# EAGLE design LME49811 (EAGLE 5.07)
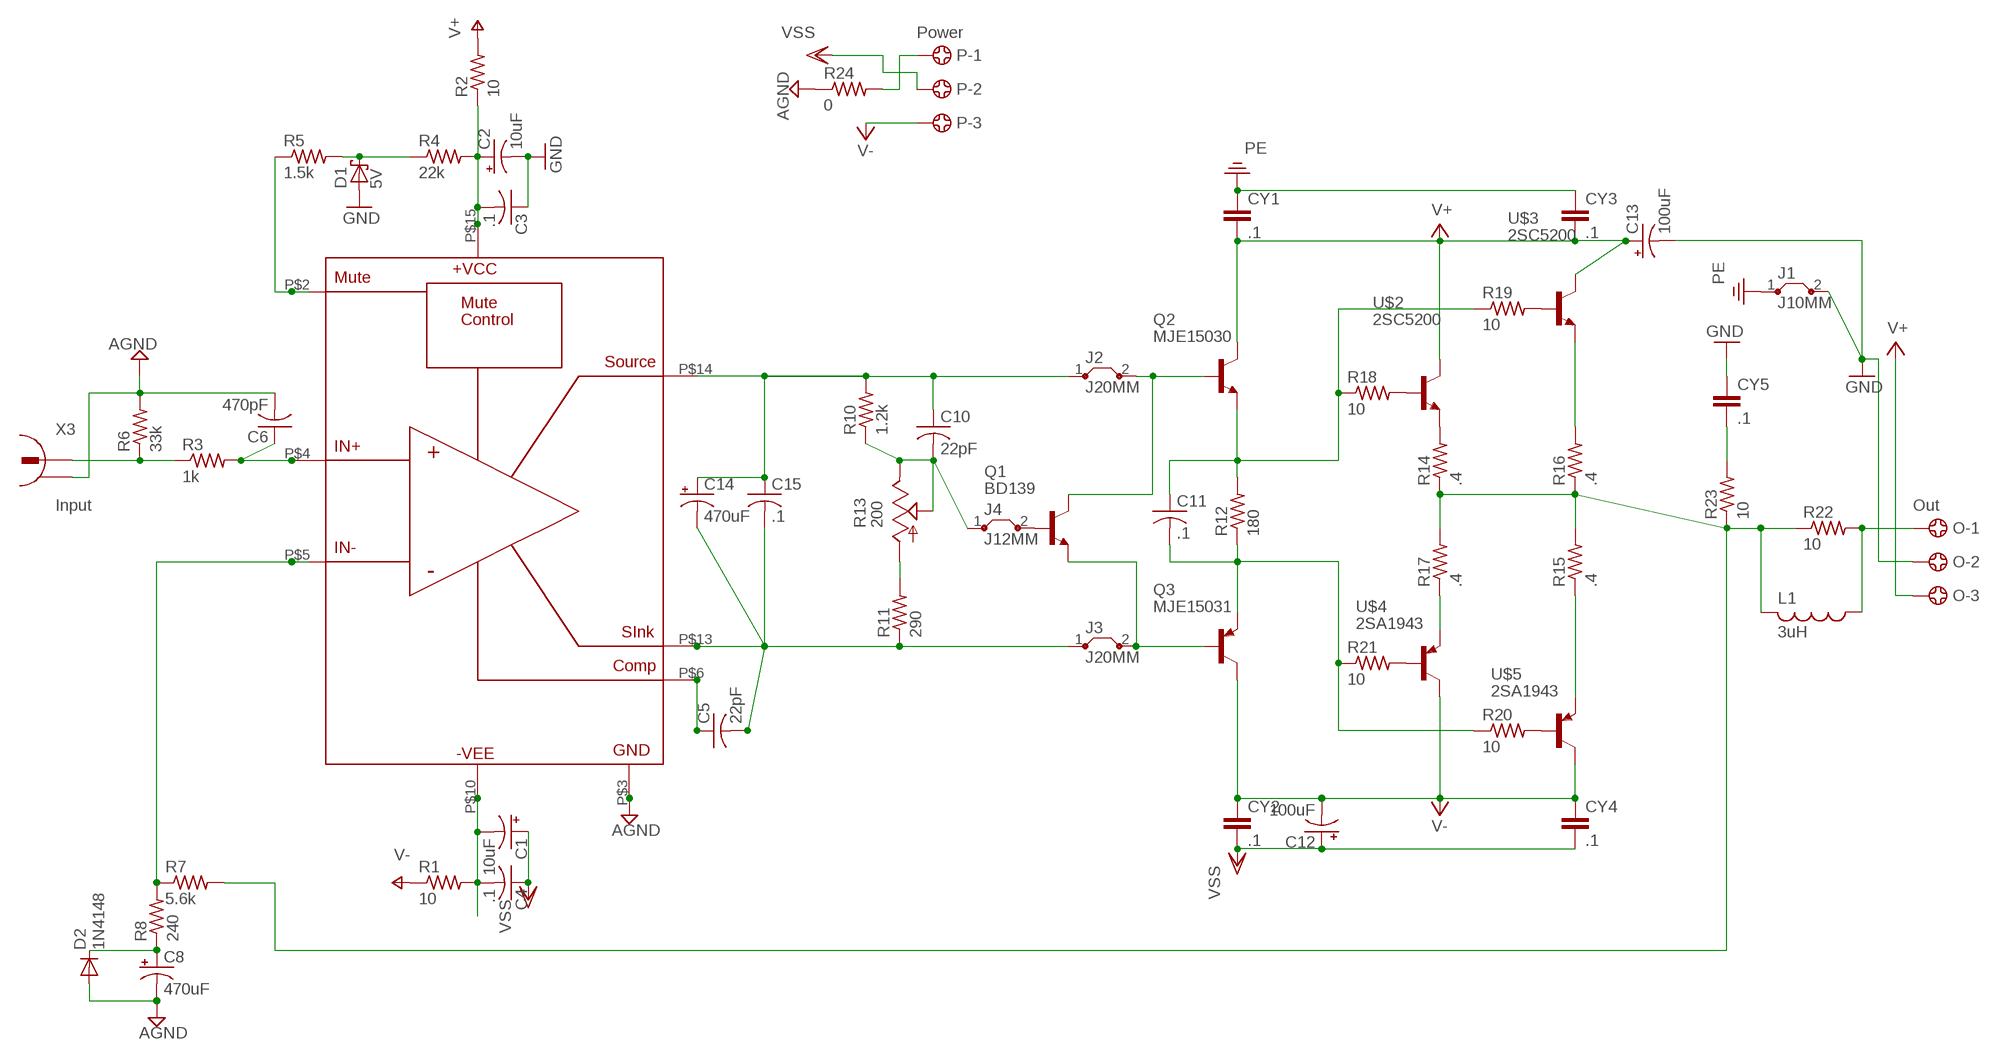
[diagram p0: schematic, sheet 1]

## Parts
C1  10uF  CPOL-USE2.5-7  [E2,5-7]
C2  10uF  CPOL-USE2.5-7  [E2,5-7]
C3  .1  C-US050-050X075  [C050-050X075]
C4  .1  C-US050-050X075  [C050-050X075]
C5  22pF  C-US075-042X103  [C075-042X103]
C6  470pF  C-US050-045X075  [C050-045X075]
C8  470uF  CPOL-USE5-10.5  [E5-10,5]
C10  22pF  C-US050-050X075  [C050-050X075]
C11  .1  C-US075-042X103  [C075-042X103]
C12  100uF  CPOL-USE7.5-18  [E7,5-18]
C13  100uF  CPOL-USE7.5-18  [E7,5-18]
C14  470uF  CPOL-USE5-10.5  [E5-10,5]
C15  .1  C-US075-052X106  [C075-052X106]
CY1  .1  CYYC15B6  [YC15B6]
CY2  .1  CYYC15B6  [YC15B6]
CY3  .1  CYYC15B6  [YC15B6]
CY4  .1  CYYC15B6  [YC15B6]
CY5  .1  CYYC15B6  [YC15B6]
D1  5V  1N5817-B  [DO41-7.6]
D2  1N4148  UF4003  [DO41-10]
J1  J10MM  [10]
J2  J20MM  [20]
J3  J20MM  [20]
J4  J12MM  [12]
L1  3uH  L-US0207/12  [0207/12]
O  Out  5202-03-N-02  [5202-03-N-02]
P  Power  5202-03-N-02  [5202-03-N-02]
Q1  BD139  [TO126]
Q2  MJE15030  BD243  [TO220]
Q3  MJE15031  DB244  [TO220]
R1  10  R-US_0309/10  [0309/10]
R2  10  R-US_0309/10  [0309/10]
R3  1k  R-US_0204/7  [0204/7]
R4  22k  R-US_0204/7  [0204/7]
R5  1.5k  R-US_0207/10  [0207/10]
R6  33k  R-US_0207/12  [0207/12]
R7  5.6k  R-US_0207/15  [0207/15]
R8  240  R-US_0204/7  [0204/7]
R10  1.2k  R-US_0204/7  [0204/7]
R11  290  R-US_0204/7  [0204/7]
R12  180  R-US_0309/12  [0309/12]
R13  200  TRIM_US-B64W  [B64W]
R14  .4  R-US_0817/22  [P0817/22]
R15  .4  R-US_0817/22  [P0817/22]
R16  .4  R-US_0817/22  [P0817/22]
R17  .4  R-US_0817/22  [P0817/22]
R18  10  R-US_0207/12  [0207/12]
R19  10  R-US_0207/12  [0207/12]
R20  10  R-US_0207/12  [0207/12]
R21  10  R-US_0207/12  [0207/12]
R22  10  R-US_0309/12  [0309/12]
R23  10  R-US_0309/12  [0309/12]
R24  0  R-US_0204/7  [0204/7]
U$1  LME49810  [TB15A]
U$2  2SC5200  MJL4281  [TO-264]
U$3  2SC5200  MJL4281  [TO-264]
U$4  2SA1943  MJL4302  [TO-264]
U$5  2SA1943  MJL4302  [TO-264]
X3  Input  736880-49  [736880-49]

## Nets
AGND: C6.2 C8.- D2.A R6.2 R24.1 U$1.P$3(GND) X3.2
GND: C2.- C3.1 C13.- CY5.1 D1.A J1.2 O.2
N$2: J2.2 Q1.2(C) Q2.1(B)
N$3: J4.2 Q1.3(B)
N$4: J3.2 Q1.1(E) Q3.1(B)
N$6: C1.- C4.2 R1.2 U$1.P$10(-VEE)
N$7: D1.C R4.1 R5.2
N$8: P.1 R24.2
N$9: R5.1 U$1.P$2(MUTE)
N$10: C5.1 U$1.P$6(COMP)
N$11: C5.2 C14.- C15.2 J3.1 R11.1 U$1.P$13(SINK)
N$12: C6.1 R3.2 U$1.P$4(IN+)
N$13: R3.1 R6.1 X3.1
N$15: C10.2 J4.1 R10.1 R13.E R13.S
N$16: R11.2 R13.A
N$17: C11.1 Q2.3(E) R12.2 R18.1 R19.1
N$18: C11.2 Q3.3(E) R12.1 R20.1 R21.1
N$19: R14.2 U$2.E
N$20: R16.2 U$3.E
N$21: R15.1 U$5.E
N$22: R17.1 U$4.E
N$24: CY5.2 R23.2
N$25: R18.2 U$2.B
N$26: R19.2 U$3.B
N$27: R21.2 U$4.B
N$28: R20.2 U$5.B
N$29: C8.+ D2.C R8.1
N$30: L1.1 O.1 R22.2
N$31: R7.1 R8.2 U$1.P$5(IN-)
N$32: C10.1 C14.+ C15.1 J2.1 R10.2 U$1.P$14(SOURCE)
N$33: L1.2 R7.2 R14.1 R15.2 R16.1 R17.2 R22.1 R23.1
N$34: C2.+ C3.2 R2.1 R4.2 U$1.P$15(+VCC)
PE: CY1.1 CY3.1 J1.1
V+: C13.+ CY1.2 CY3.2 O.3 Q2.2(C) R2.2 U$2.C U$3.C
V-: C12.- CY2.1 CY4.1 P.3 Q3.2(C) R1.1 U$4.C U$5.C
VSS: C1.+ C4.1 C12.+ CY2.2 CY4.2 P.2
Unconnected: X3.2@2

## Library data of the parts
C1 C2 C8 C12-C14 = resistor:CPOL-US: POLARIZED CAPACITOR, American symbol
C3-C6 C10 C11 C15 = resistor:C-US: CAPACITOR, American symbol
CY1-CY5 = resistor:CY: Y CAPACITOR for power line
D1 = diode:1N581*: 1.0A SCHOTTKY BARRIER RECTIFIER Source: http://www.diodes.com/datasheets/ds23001.pdf
D2 = diode:UF4003: DIODE ultrafast recovery diode, 200 V rectifier
J1-J4 = jumper:J: Bridge
L1 = resistor:L-US: INDUCTOR, American symbol
O P = con-ebyelectro:5202-03-N-02: Barrier Blocks Sreies 5202 Source: http://www.ebyelectro.com/PDF/5202-XX-N-02.pdf
Q1 = transistor-npn:BD139*: NPN Transistor
Q2 = transistor-npn:BD243*: NPN Transistor
Q3 = transistor-pnp:DB244: PNP Transistor
R1-R8 R10-R12 R14-R24 = resistor:R-US_: RESISTOR, American symbol
R13 = pot:TRIM_US-: POTENTIOMETER
U$1 = LME49811:LME49810
U$2 U$3 = Rudi_TO264:MJL4281: MJL4281 NPN BCE TO-264
U$4 U$5 = Rudi_TO264:MJL4302: MJL4302 PNP BCE TO-264
X3 = con-conrad:736880-49: Cinch Connector ( RCA Jack )

## Board
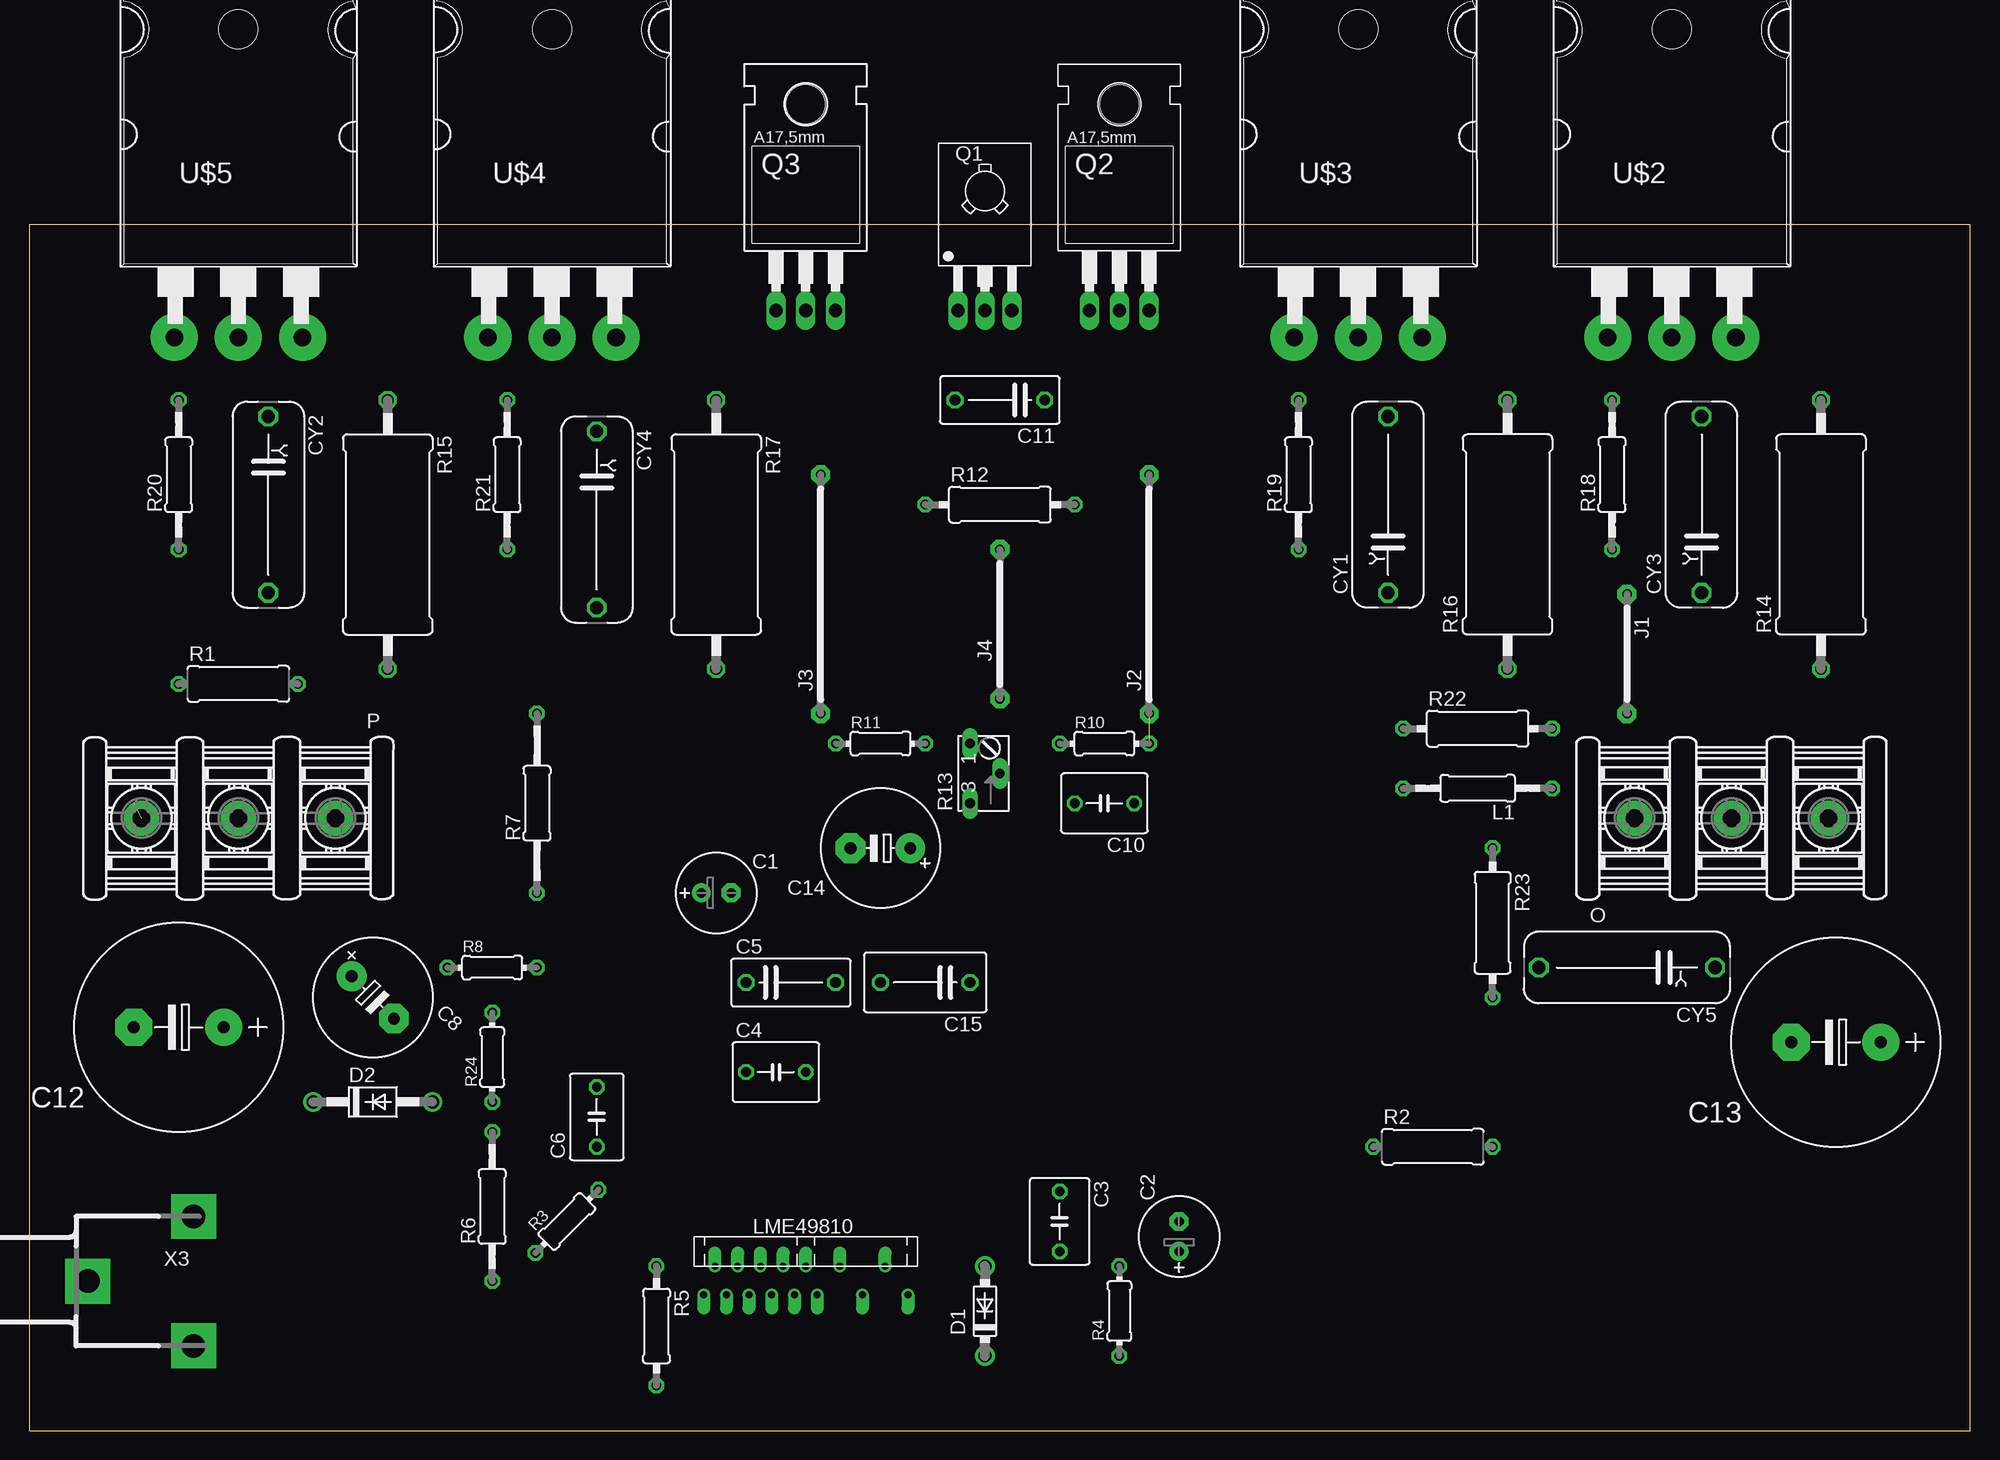
[diagram p1: board, top side]
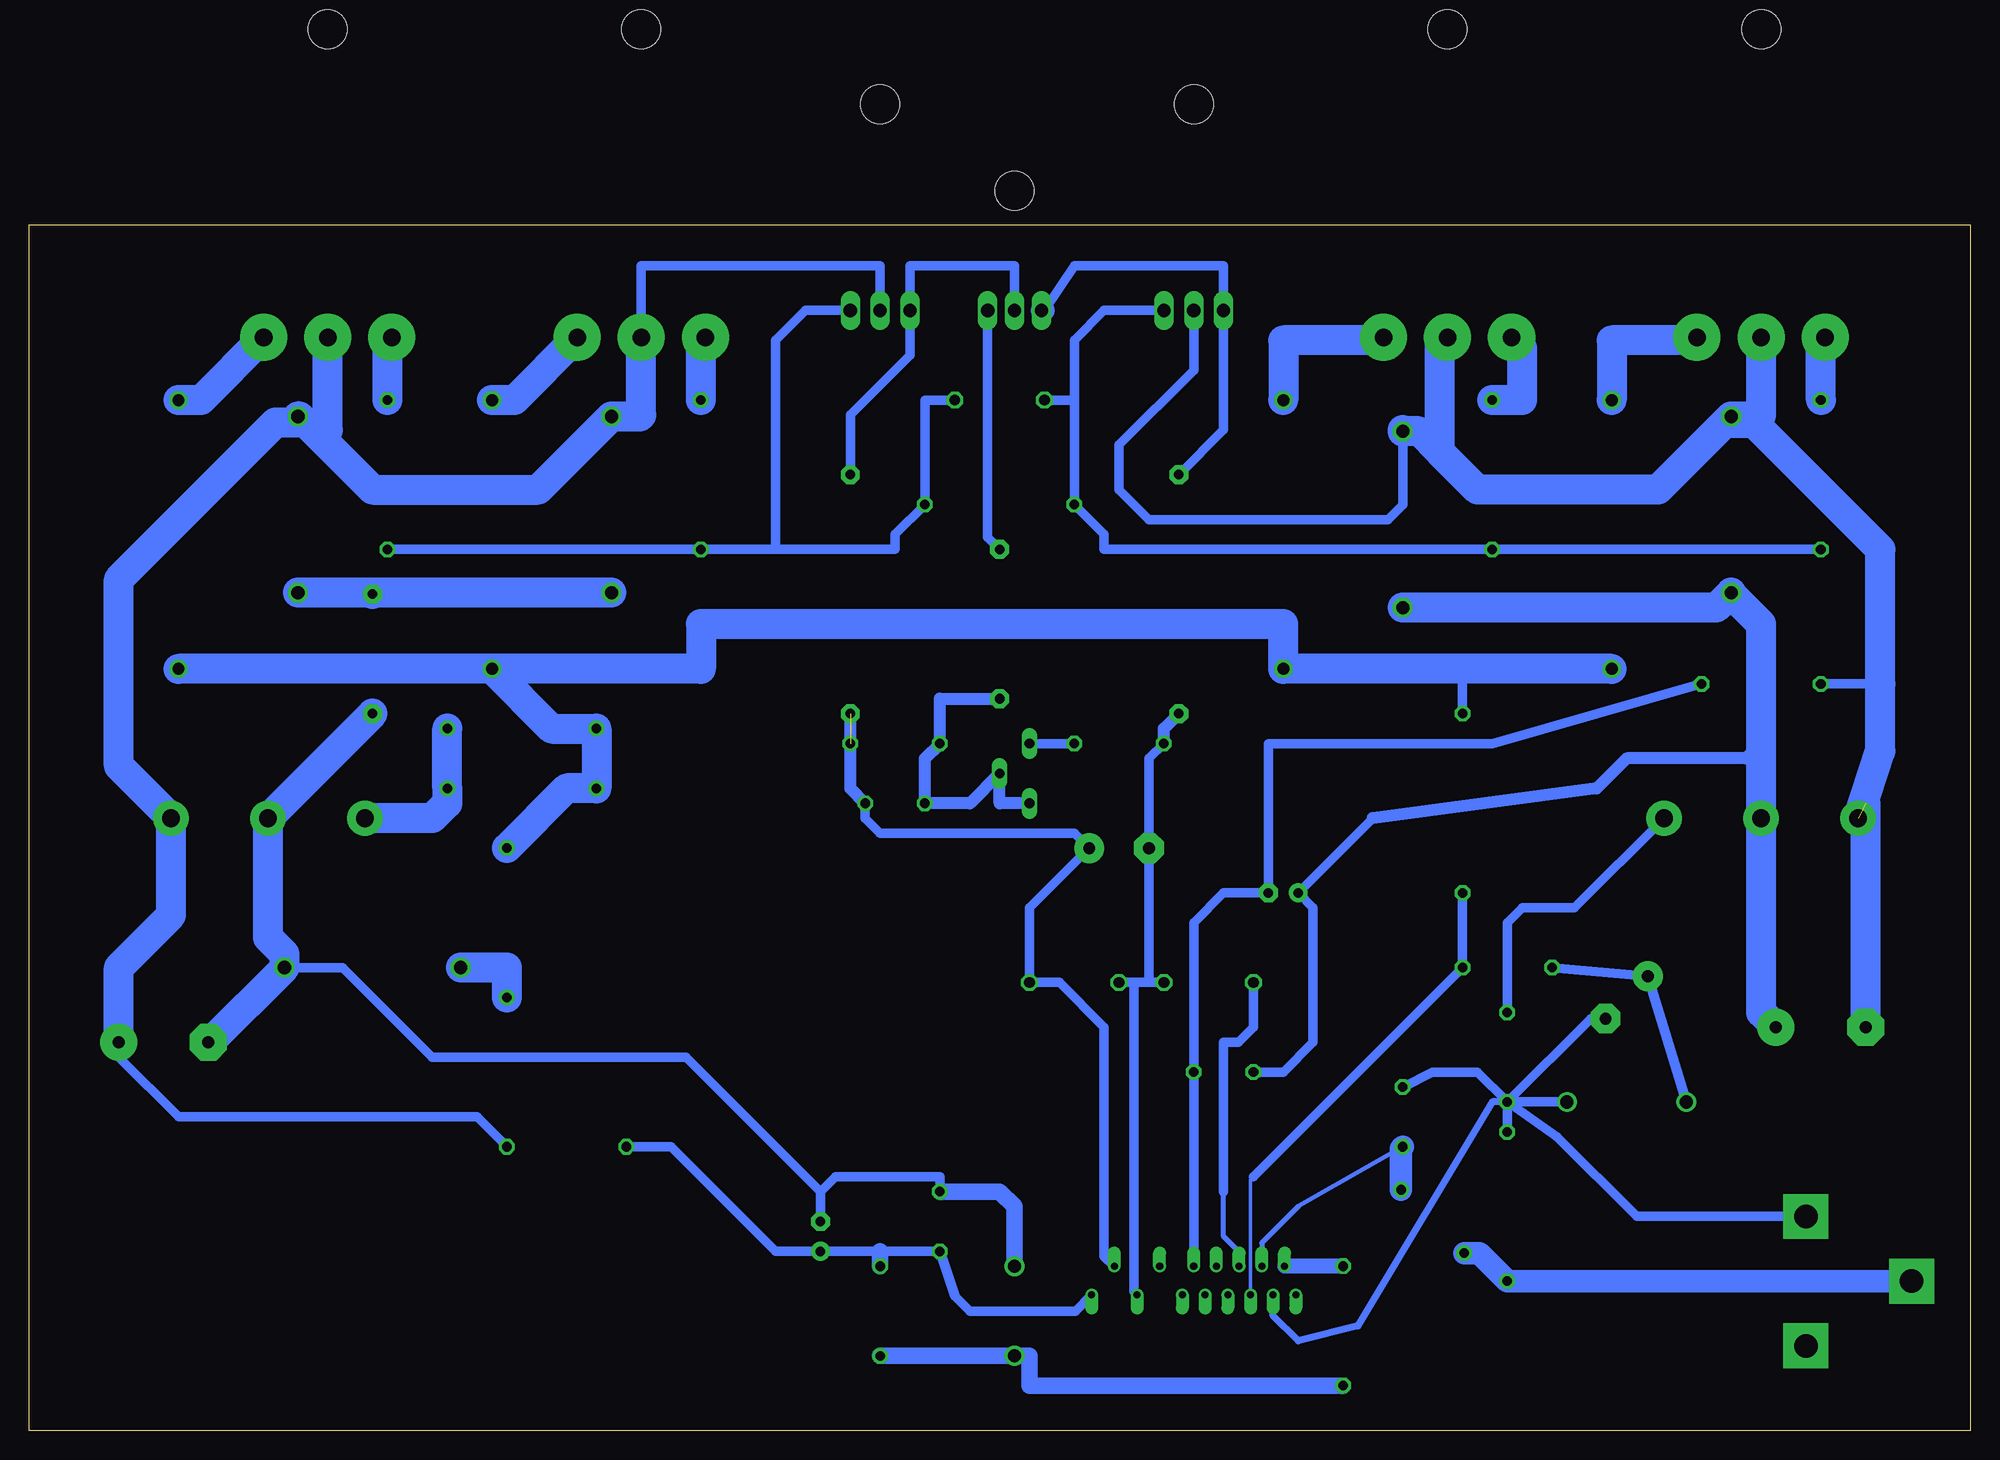
[diagram p2: board, bottom side, seen from below]

Size 165.08 x 102.54 mm. Coordinates in mm from the lower left corner, seen from the top.
Outline: 0,0 165.08,0 165.08,102.54 0,102.54 0,0
Copper layers (1*16): Top 0.035mm / dielectric 1.5mm / Bottom 0.035mm
Design rules "default": minimum track width 10mil, minimum drill 24mil, track to track 8mil, track to pad 8mil, pad to pad 8mil, via to via 8mil, smd to smd 8mil, copper to edge 40mil, drill to drill 8mil, minimum pad ring 10mil, minimum via ring 8mil, stop-mask expansion 4mil, vias tented up to drill 0mil, thermal gap 10mil

### Footprints (pad centres in the part's own frame; a part is rotated, then mirrored left to right if it is on the bottom)
E2,5-7 = drill 0.813 pad 1.6 round: + -1.27,0 | drill 0.813 pad 1.6 octagon: - 1.27,0
C050-050X075 = drill 0.813 octagon: 1 -2.54,0; 2 2.54,0
C075-042X103 = drill 0.914 octagon: 1 -3.81,0; 2 3.81,0
C050-045X075 = drill 0.813 octagon: 1 -2.54,0; 2 2.54,0
E5-10,5 = drill 1.016 pad 2.54 round: + -2.54,0 | drill 1.016 pad 2.54 octagon: - 2.54,0
E7,5-18 = drill 1.016 pad 3.15 round: + -3.81,0 | drill 1.016 pad 3.15 octagon: - 3.81,0
C075-052X106 = drill 0.914 octagon: 1 -3.81,0; 2 3.81,0
YC15B6 = drill 1.118 octagon: 1 -7.493,0; 2 7.493,0
DO41-7.6 = drill 1.1 pad 1.7 round: A 3.81,0; C -3.81,0
DO41-10 = drill 1.118 round: A 5.08,0; C -5.08,0
10 = drill 0.813 pad 1.6 octagon: 1 -5.08,0; 2 5.08,0
20 = drill 0.813 pad 1.6 octagon: 1 -10.16,0; 2 10.16,0
12 = drill 0.813 pad 1.6 octagon: 1 -6.35,0; 2 6.35,0
0207/12 = drill 0.813 octagon: 1 -6.35,0; 2 6.35,0
5202-03-N-02 = drill 1.5 pad 3 round: 1 -8.25,0; 2 0,0; 3 8.25,0
TO126 = drill 1.118 long: 1 -2.286,-5.08; 2 0,-5.08; 3 2.286,-5.08 | hole 3.302: 0,5.08
TO220 = drill 1.118 long: 1 -2.54,-6.35; 2 0,-6.35; 3 2.54,-6.35 | hole 3.302: 0,11.176
0309/10 = drill 0.813 octagon: 1 -5.08,0; 2 5.08,0
0204/7 = drill 0.813 octagon: 1 -3.81,0; 2 3.81,0
0207/10 = drill 0.813 octagon: 1 -5.08,0; 2 5.08,0
0207/15 = drill 0.813 octagon: 1 -7.62,0; 2 7.62,0
0309/12 = drill 0.813 octagon: 1 -6.35,0; 2 6.35,0
B64W = drill 0.813 long: A 2.54,0; E -2.54,0; S 0,-2.54
P0817/22 = drill 1.016 octagon: 1 -11.43,0; 2 11.43,0
TB15A = drill 0.6 pad 1.016 offset: P$1 -8.685,-2.43; P$2 -7.72,0; P$3 -6.755,-2.43; P$4 -5.79,0; P$5 -4.825,-2.43; P$6 -3.86,0; P$7 -2.895,-2.43; P$8 -1.93,0; P$9 -0.965,-2.43; P$10 0,0; P$11 0.965,-2.43; P$12 2.895,0; P$13 4.825,-2.43; P$14 6.755,0; P$15 8.685,-2.43
TO-264 = drill 1.5 pad 4 round: B -5.45,-6.096; E 5.45,-6.096 | drill 1.499 pad 4 round: C 0,-6.096 | hole 3.3: 0,20.09
736880-49 = drill 2 pad 3.81 square: 1 -3.92,0; 2 5.08,5.5; 2@2 5.08,-5.5

### Placement (x,y rotation side)
C1  58.42,45.72 0 top
C2  97.79,16.51 90 top
C3  87.63,17.78 270 top
C4  63.5,30.48 0 top
C5  64.77,38.1 0 top
C6  48.26,26.67 90 top
C8  29.21,36.83 315 top
C10  91.44,53.34 180 top
C11  82.55,87.63 180 top
C12  12.7,34.29 180 top
C13  153.67,33.02 180 top
C14  72.39,49.53 180 top
C15  76.2,38.1 180 top
CY1  115.57,78.74 90 top
CY2  20.32,78.74 270 top
CY3  142.24,78.74 90 top
CY4  48.26,77.47 270 top
CY5  135.89,39.37 180 top
D1  81.28,10.16 90 top
D2  29.21,27.94 0 top
J1  135.89,66.04 270 top
J2  95.25,71.12 90 top
J3  67.31,71.12 90 top
J4  82.55,68.58 90 top
L1  123.19,54.61 180 top
O  144.78,52.07 0 top
P  17.78,52.07 180 top
Q1  81.28,100.33 0 top
Q2  92.71,101.6 0 top
Q3  66.04,101.6 0 top
R1  17.78,63.5 0 top
R2  119.38,24.13 0 top
R3  45.72,17.78 45 top
R4  92.71,10.16 90 top
R5  53.34,8.89 270 top
R6  39.37,19.05 90 top
R7  43.18,53.34 90 top
R8  39.37,39.37 0 top
R10  91.44,58.42 0 top
R11  72.39,58.42 0 top
R12  82.55,78.74 0 top
R13  80.01,55.88 90 top
R14  152.4,76.2 90 top
R15  30.48,76.2 270 top
R16  125.73,76.2 90 top
R17  58.42,76.2 270 top
R18  134.62,81.28 90 top
R19  107.95,81.28 90 top
R20  12.7,81.28 90 top
R21  40.64,81.28 90 top
R22  123.19,59.69 0 top
R23  124.46,43.18 270 top
R24  39.37,31.75 90 top
U$1  66.04,13.97 0 top
U$2  139.7,99.06 0 top
U$3  113.03,99.06 0 top
U$4  44.45,99.06 0 top
U$5  17.78,99.06 0 top
X3  8.89,12.7 0 top

### Tracks (layer width: path | path; a pad name or v marks a point on that pad's centre or on a via)
AGND
  Bottom 0.61: U$1.P$3 59.28,9.75 57.15,7.62 52.07,8.89 40.64,27.94 R24.1
  Bottom 0.813: R24.1 35.14,24.98 28.36,18.2 X3.2 | R24.1 D2.A | C8.- 32.28,35.03 R24.1 | R24.1 R6.2 | C6.2 45.72,30.48 41.91,30.48 R24.1
GND
  Bottom 0.813: C3.1 87.63,21.59 96.52,21.59 97.79,20.32 | 97.79,20.32 C2.- | 97.79,20.32 109.22,31.75 130.81,31.75 138.43,39.37 CY5.1
  Bottom 1.422: D1.A 81.28,19.05 82.55,20.32 C3.1
  Bottom 2.54: J1.2 O.2 144.78,41.91 143.38,40.51 CY5.1 149.73,33.02 C13.-
N$2
  Bottom 0.813: J2.2 95.25,86.36 90.17,91.44 Q2.1 90.17,99.06 81.28,99.06 Q1.2
N$3
  Bottom 0.813: J4.2 83.57,75.95 Q1.3
N$4
  Bottom 0.813: 78.74,95.25 76.2,99.06 63.5,99.06 Q3.1 63.5,85.09 J3.2
  Bottom 1.778: 78.74,95.25 Q1.1
N$6
  Bottom 0.813: U$1.P$10 C4.2 66.04,43.18 63.5,45.72 C1.- 59.69,58.42 40.64,58.42 R1.2
N$7
  Bottom 1.422: R5.2 78.74,3.81 80.01,3.81 80.01,6.35 D1.C R4.1
N$8
  Bottom 0.813: R24.2 39.37,43.18 38.1,44.45 33.65,44.45 P.1
N$9
  Bottom 1.27: R5.1 U$1.P$2
N$10
  Bottom 0.406: 62.23,14.02 62.23,15.24 63.5,16.51 63.5,20.32
  Bottom 0.813: U$1.P$6 62.23,14.02 | C5.1 60.96,34.29 62.23,33.02 63.5,33.02 63.5,20.32
N$11
  Bottom 0.813: R11.1 69.85,57.15 C14.- 69.85,38.1 | 69.85,38.1 C5.2 | 71.12,38.1 69.85,38.1 | 71.12,38.1 C15.2 | U$1.P$13 71.12,11.8 71.12,38.1
  Bottom 1.016: J3.1 68.58,59.69 R11.1
N$12
  Bottom 0.406: U$1.P$4 60.25,15.95 57.15,19.05 C6.1
  Bottom 1.93: R3.2 48.41,23.98 C6.1
N$13
  Bottom 1.93: R3.1 41.76,15.09 R6.1 X3.1
N$15
  Bottom 1.016: J4.1 87.63,62.23 R10.1 88.9,57.15 C10.2 85.09,53.34 R13.S 82.55,53.34 R13.E
N$16
  Bottom 0.813: R11.2 R13.A
N$17
  Bottom 0.813: R18.1 R19.1 101.6,74.93 | 101.6,74.93 91.44,74.93 91.44,76.2 R12.2 88.9,87.63 C11.1 | Q2.3 99.06,95.25 101.6,92.71 101.6,74.93
N$18
  Bottom 0.813: R20.1 R21.1 73.66,74.93 73.66,76.2 R12.1 76.2,87.63 | 76.2,87.63 C11.2 | Q3.3 73.66,95.25 76.2,92.71 76.2,87.63
N$19
  Bottom 2.54: U$2.E 150.48,87.63 R14.2
N$20
  Bottom 2.54: U$3.E 123.81,87.63 R16.2
N$21
  Bottom 2.54: U$5.E 23.48,92.71 30.48,92.71 R15.1
N$22
  Bottom 2.54: U$4.E 50.15,92.71 58.42,92.71 R17.1
N$24
  Bottom 2.54: R23.2 124.46,39.37 CY5.2
N$25
  Bottom 2.54: U$2.B 134.62,92.59 R18.2
N$26
  Bottom 2.54: U$3.B 107.95,92.59 R19.2
N$27
  Bottom 2.54: U$4.B 38.1,92.06 38.1,87.63 R21.2
N$28
  Bottom 2.54: U$5.B 12.7,92.59 R20.2
N$29
  Bottom 0.813: R8.1 C8.+ D2.C
N$30
  Bottom 2.54: R22.2 L1.1 129.54,53.34 130.81,52.07 O.1
N$31
  Bottom 0.305: U$1.P$5 61.21,21.34 60.96,21.59
  Bottom 0.813: R7.1 R8.2 60.96,21.59
N$32  (1 unrouted)
  Bottom 0.813: C10.1 93.98,52.07 92.71,50.8 76.2,50.8 C14.+ 80.01,44.45 C15.1 77.47,38.1 73.66,34.29 73.66,14.84 U$1.P$14
  Bottom 1.016: C10.1 95.25,54.61 J2.1
N$33
  Bottom 0.813: 43.18,64.77 R7.2
  Bottom 2.54: R15.2 43.18,64.77 R17.2 58.42,68.58 107.95,68.58 107.95,64.77 R16.1 | R16.1 R14.1 | R23.1 119.38,54.61 L1.2 R22.1 120.65,59.69 R16.1
N$34
  Bottom 0.813: U$1.P$15 76.11,10.16 85.09,10.16 86.36,11.43 C3.2 92.71,15.24 C2.+ 101.6,15.24 110.49,24.13 R2.1
  Bottom 1.422: 92.71,15.24 R4.2
PE
  Bottom 2.54: CY1.1 136.02,71.25 | CY3.1 140.97,71.25 136.02,71.25 | 136.02,71.25 J1.1
V+
  Bottom 0.813: Q2.2 92.71,99.06 113.03,99.06 U$3.C 113.03,92.71 | R2.2 127,26.67 152.4,26.67 157.48,31.75 C13.+
  Bottom 2.54: 113.03,92.71 113.03,86.36 113.16,86.23 CY1.2 121.79,80.01 135.89,80.01 140.33,84.46 | 141.6,85.73 140.33,84.46 | 141.6,85.73 142.11,86.23 CY3.2 | U$2.C 139.7,85.09 140.33,84.46 | C13.+ 157.48,39.37 153.03,43.82 O.3 157.48,56.52 157.48,72.39 144.14,85.73 141.6,85.73
V-  (1 unrouted)
  Bottom 0.813: 48.26,85.09 48.26,78.74 49.53,77.47 69.85,77.47 72.39,80.01 72.39,83.82 66.04,90.17 Q3.2 | 7.62,63.5 R1.1
  Bottom 2.54: U$5.C 17.78,86.36 17.91,86.23 CY2.1 20.89,85.66 | 20.89,85.66 26.54,80.01 41.91,80.01 45.08,83.19 | 45.08,83.19 46.86,84.96 CY4.1 48.26,85.09 | U$4.C 45.08,92.33 45.08,83.19 | P.3 7.62,57.79 7.62,63.5 7.62,74.93 18.35,85.66 20.89,85.66 | C12.- 8.89,53.34
VSS
  Bottom 0.813: C4.1 58.42,30.48 55.88,33.02 55.88,44.45 C1.+ 50.8,52.07
  Bottom 1.016: 50.8,52.07 31.75,54.61 29.21,57.15 19.05,57.15 17.78,58.42
  Bottom 2.54: CY4.2 21.59,69.98 CY2.2 20.32,71.12 17.78,68.58 17.78,58.42 P.2 17.78,35.56 C12.+